# EAGLE design pan_schematic (EAGLE 9.6.2)
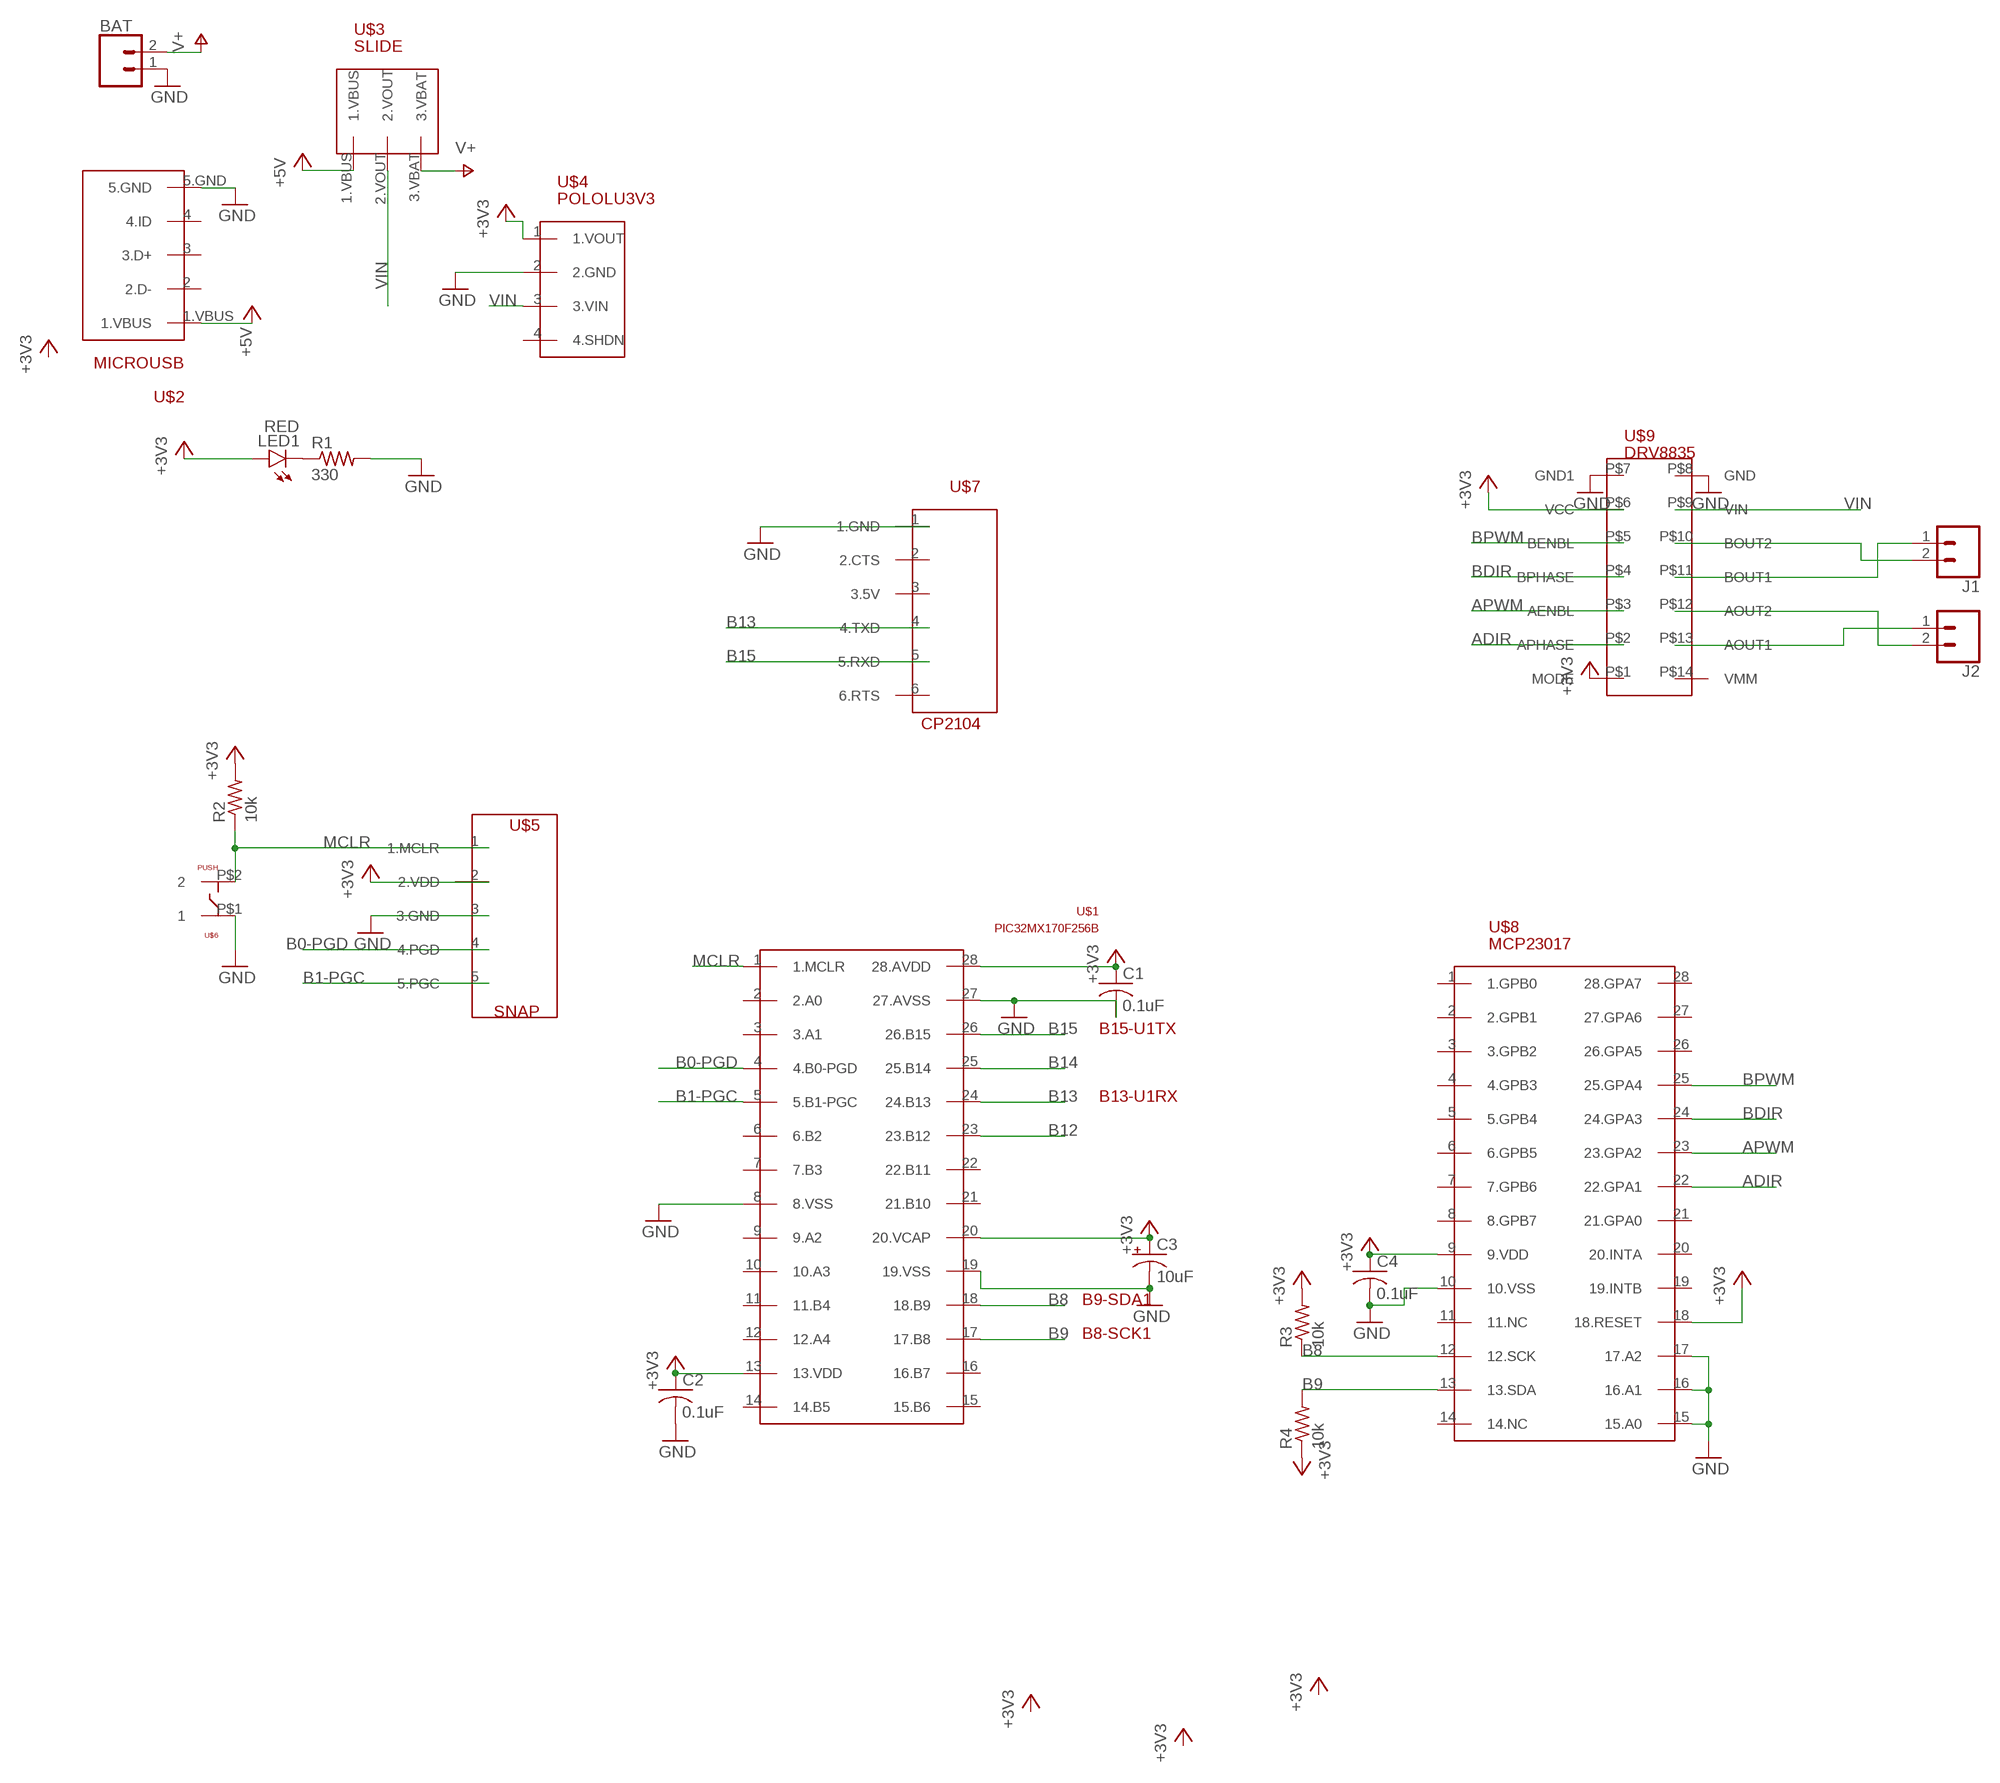
[diagram p0: schematic, sheet 1]

## Parts
BAT  CONN_02  [1X02]
C1  0.1uF  C-US025-030X050  [C025-030X050]
C2  0.1uF  C-US025-030X050  [C025-030X050]
C3  10uF  CPOL-USB45181B  [B45181B]
C4  0.1uF  C-US025-030X050  [C025-030X050]
J1  CONN_02POLAR  [MOLEX-1X2]
J2  CONN_02POLAR  [MOLEX-1X2]
LED1  RED  LED3MM  [LED3MM]
R1  330  R-US_0207/10  [0207/10]
R2  10k  R-US_0207/10  [0207/10]
R3  10k  R-US_M2012  [M2012]
R4  10k  R-US_M2012  [M2012]
U$1  PIC32MX170F256B  [DIL28-3]
U$2  MICROUSB  [MICROUSB]
U$3  SLIDE  [SLIDE]
U$4  POLOLU3V3  [POLOLU3V3]
U$5  SNAP  [1X05_1.27MM]
U$6  PUSH  [PUSH]
U$7  CP2104  [1X06]
U$8  MCP23017  [MCP23017]
U$9  DRV8835  [DRV8835]

## Nets
+3V3: C1.1 C2.1 C3.+ C4.1 LED1.A R2.2 R3.2 R4.1 U$1.13(13.VDD) U$1.20(20.VCAP) U$1.28(28.AVDD) U$4.1(1.VOUT) U$5.2(2.VDD) U$8.9(9.VDD) U$8.18(18.RESET) U$9.P$6(VCC)
+5V: U$2.1.VBUS U$3.1.VBUS
ADIR: U$8.22(22.GPA1) U$9.P$2(APHASE)
APWM: U$8.23(23.GPA2) U$9.P$3(AENBL)
B0-PGD: U$1.4(4.B0-PGD) U$5.4(4.PGD)
B1-PGC: U$1.5(5.B1-PGC) U$5.5(5.PGC)
B8: R3.1 U$1.18(18.B9) U$8.12(12.SCK)
B9: R4.2 U$1.17(17.B8) U$8.13(13.SDA)
B12: U$1.23(23.B12)
B13: U$1.24(24.B13) U$7.4(4.TXD)
B14: U$1.25(25.B14)
B15: U$1.26(26.B15) U$7.5(5.RXD)
BDIR: U$8.24(24.GPA3) U$9.P$4(BPHASE)
BPWM: U$8.25(25.GPA4) U$9.P$5(BENBL)
GND: BAT.1 C1.2 C2.2 C3.- C4.2 R1.2 U$1.8(8.VSS) U$1.19(19.VSS) U$1.27(27.AVSS) U$2.5.GND U$4.2(2.GND) U$5.3(3.GND) U$6.P$1 U$7.1(1.GND) U$8.10(10.VSS) U$8.15(15.A0) U$8.16(16.A1) U$8.17(17.A2)
MCLR: R2.1 U$1.1(1.MCLR) U$5.1(1.MCLR) U$6.P$2
N$1: LED1.K(C) R1.1
N$2: J1.1 U$9.P$11(BOUT1)
N$3: J1.2 U$9.P$10(BOUT2)
N$4: J2.2 U$9.P$12(AOUT2)
N$5: J2.1 U$9.P$13(AOUT1)
V+: BAT.2 U$3.3.VBAT
VIN: U$3.2.VOUT U$4.3(3.VIN) U$9.P$9(VIN)
Unconnected: U$1.2(2.A0) U$1.3(3.A1) U$1.6(6.B2) U$1.7(7.B3) U$1.9(9.A2) U$1.10(10.A3) U$1.11(11.B4) U$1.12(12.A4) U$1.14(14.B5) U$1.15(15.B6) U$1.16(16.B7) U$1.21(21.B10) U$1.22(22.B11) U$2.2(2.D-) U$2.3(3.D+) U$2.4(4.ID) U$4.4(4.SHDN) U$7.2(2.CTS) U$7.3(3.5V) U$7.6(6.RTS) U$8.1(1.GPB0) U$8.2(2.GPB1) U$8.3(3.GPB2) U$8.4(4.GPB3) U$8.5(5.GPB4) U$8.6(6.GPB5) U$8.7(7.GPB6) U$8.8(8.GPB7) U$8.11(11.NC) U$8.14(14.NC) U$8.19(19.INTB) U$8.20(20.INTA) U$8.21(21.GPA0) U$8.26(26.GPA5) U$8.27(27.GPA6) U$8.28(28.GPA7) U$9.P$1(MODE) U$9.P$7(GND1) U$9.P$8(GND) U$9.P$14(VMM)

## Notes on the sheet
- B15-U1TX
- B13-U1RX
- B9-SDA1
- B8-SCK1

## Library data of the parts
BAT = pan_pic32:CONN_02: Multi connection point. Often used as Generic Header-pin footprint for 0.1 inch spaced/style header connections On any of the 0.1 inch spaced packages, you can populate with these: Break Away Headers - Straight <https://www.sparkfun.com/products/116> (PRT-00116) Break Away Male Headers - Right Angle <https://www.sparkfun.com/products/553> (PRT-00553) Female Headers <https://www.sparkfun.com/products/115> (PRT-00115) Break Away Headers - Machine Pin <https://www.sparkfun.com/products/117> (PRT-00117) Break Away Female Headers - Swiss Machine Pin <https://www.sparkfun.com/products/743> (PRT-00743) For SCREWTERMINALS and SPRING TERMINALS visit here: Screw Terimnals on SparkFun.com <https://www.sparkfun.com/search/results?term=Screw+Terminals> (5mm/3.5mm/2.54mm spacing) This device is also useful as a general connection point to wire up your design to another part of your project. Our various solder wires solder well into these plated through hole pads. Hook-Up Wire - Assortment (Stranded, 22 AWG) <https://www.sparkfun.com/products/11375> (PRT-11375) Hook-Up Wire - Assortment (Solid Core, 22 AWG) <https://www.sparkfun.com/products/11367> (PRT-11367) View the entire wire category on our website here <https://www.sparkfun.com/categories/141> Special notes: Molex polarized connector foot print use with: PRT-08233 with associated crimp pins and housings. 2.54_SCREWTERM for use with PRT-10571. 3.5mm Screw Terminal footprints for PRT-08084 5mm Screw Terminal footprints for use with PRT-08432
C1 C2 C4 = pan_pic32:C-US: CAPACITOR, American symbol; SPICEPREFIX: C
C3 = pan_pic32:CPOL-US: POLARIZED CAPACITOR, American symbol; SPICEPREFIX: C
J1 J2 = pan_pic32:CONN_02: Multi connection point. Often used as Generic Header-pin footprint for 0.1 inch spaced/style header connections On any of the 0.1 inch spaced packages, you can populate with these: Break Away Headers - Straight <https://www.sparkfun.com/products/116> (PRT-00116) Break Away Male Headers - Right Angle <https://www.sparkfun.com/products/553> (PRT-00553) Female Headers <https://www.sparkfun.com/products/115> (PRT-00115) Break Away Headers - Machine Pin <https://www.sparkfun.com/products/117> (PRT-00117) Break Away Female Headers - Swiss Machine Pin <https://www.sparkfun.com/products/743> (PRT-00743) For SCREWTERMINALS and SPRING TERMINALS visit here: Screw Terimnals on SparkFun.com <https://www.sparkfun.com/search/results?term=Screw+Terminals> (5mm/3.5mm/2.54mm spacing) This device is also useful as a general connection point to wire up your design to another part of your project. Our various solder wires solder well into these plated through hole pads. Hook-Up Wire - Assortment (Stranded, 22 AWG) <https://www.sparkfun.com/products/11375> (PRT-11375) Hook-Up Wire - Assortment (Solid Core, 22 AWG) <https://www.sparkfun.com/products/11367> (PRT-11367) View the entire wire category on our website here <https://www.sparkfun.com/categories/141> Special notes: Molex polarized connector foot print use with: PRT-08233 with associated crimp pins and housings. 2.54_SCREWTERM for use with PRT-10571. 3.5mm Screw Terminal footprints for PRT-08084 5mm Screw Terminal footprints for use with PRT-08432; SF_ID: PRT-09918
LED1 = pan_pic32:LED: LED OSRAM: - CHIPLED LG R971, LG N971, LY N971, LG Q971, LY Q971, LO R971, LY R971 LH N974, LH R974 LS Q976, LO Q976, LY Q976 LO Q996 - Hyper CHIPLED LW Q18S LB Q993, LB Q99A, LB R99A - SideLED LS A670, LO A670, LY A670, LG A670, LP A670 LB A673, LV A673, LT A673, LW A673 LH A674 LY A675 LS A676, LA A676, LO A676, LY A676, LW A676 LS A679, LY A679, LG A679 - Hyper Micro SIDELED® LS Y876, LA Y876, LO Y876, LY Y876 LT Y87S - SmartLED LW L88C, LW L88S LB L89C, LB L89S, LG L890 LS L89K, LO L89K, LY L89K LS L896, LA L896, LO L896, LY L896 - TOPLED LS T670, LO T670, LY T670, LG T670, LP T670 LSG T670, LSP T670, LSY T670, LOP T670, LYG T670 LG T671, LOG T671, LSG T671 LB T673, LV T673, LT T673, LW T673 LH T674 LS T676, LA T676, LO T676, LY T676, LB T676, LH T676, LSB T676, LW T676 LB T67C, LV T67C, LT T67C, LS T67K, LO T67K, LY T67K, LW E67C LS E67B, LA E67B, LO E67B, LY E67B, LB E67C, LV E67C, LT E67C LW T67C LS T679, LY T679, LG T679 LS T770, LO T770, LY T770, LG T770, LP T770 LB T773, LV T773, LT T773, LW T773 LH T774 LS E675, LA E675, LY E675, LS T675 LS T776, LA T776, LO T776, LY T776, LB T776 LHGB T686 LT T68C, LB T68C - Hyper Mini TOPLED® LB M676 - Mini TOPLED Santana® LG M470 LS M47K, LO M47K, LY M47K Source: http://www.osram.convergy.de LUXEON: - LUMILED® LXK2-PW12-R00, LXK2-PW12-S00, LXK2-PW14-U00, LXK2-PW14-V00 LXK2-PM12-R00, LXK2-PM12-S00, LXK2-PM14-U00 LXK2-PE12-Q00, LXK2-PE12-R00, LXK2-PE12-S00, LXK2-PE14-T00, LXK2-PE14-U00 LXK2-PB12-K00, LXK2-PB12-L00, LXK2-PB12-M00, LXK2-PB14-N00, LXK2-PB14-P00, LXK2-PB14-Q00 LXK2-PR12-L00, LXK2-PR12-M00, LXK2-PR14-Q00, LXK2-PR14-R00 LXK2-PD12-Q00, LXK2-PD12-R00, LXK2-PD12-S00 LXK2-PH12-R00, LXK2-PH12-S00 LXK2-PL12-P00, LXK2-PL12-Q00, LXK2-PL12-R00 Source: www.luxeon.com KINGBRIGHT: KA-3528ASYC Source: www.kingbright.com
R1-R4 = pan_pic32:R-US_: RESISTOR, American symbol; SPICEPREFIX: R
U$1 = pan_pic32:PIC32MX170F256B
U$2 = pan_pic32:MICROUSB
U$3 = pan_pic32:SLIDE
U$4 = pan_pic32:POLOLU3V3
U$5 = pan_pic32:SNAP
U$6 = pan_pic32:PUSH
U$7 = pan_pic32:CP2104
U$8 = pan_pic32:MCP23017
U$9 = pan_pic32:DRV8835

## Board
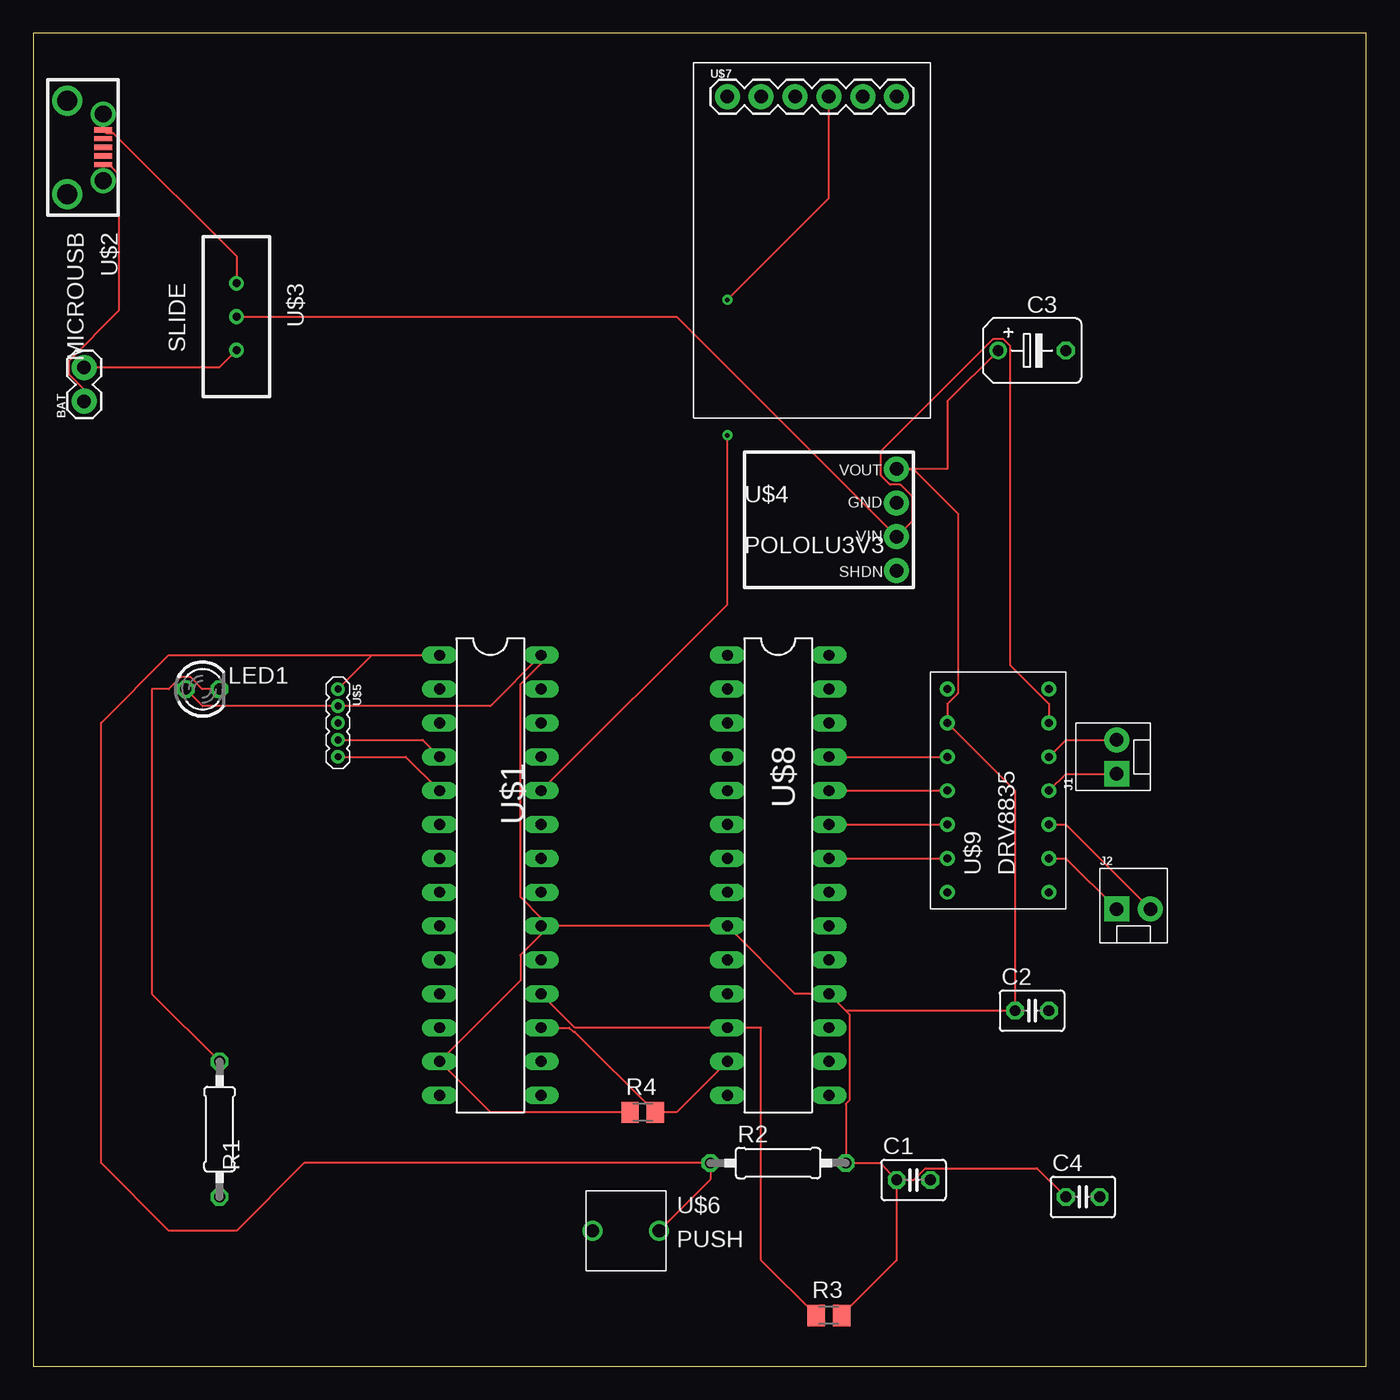
[diagram p1: board, top side]
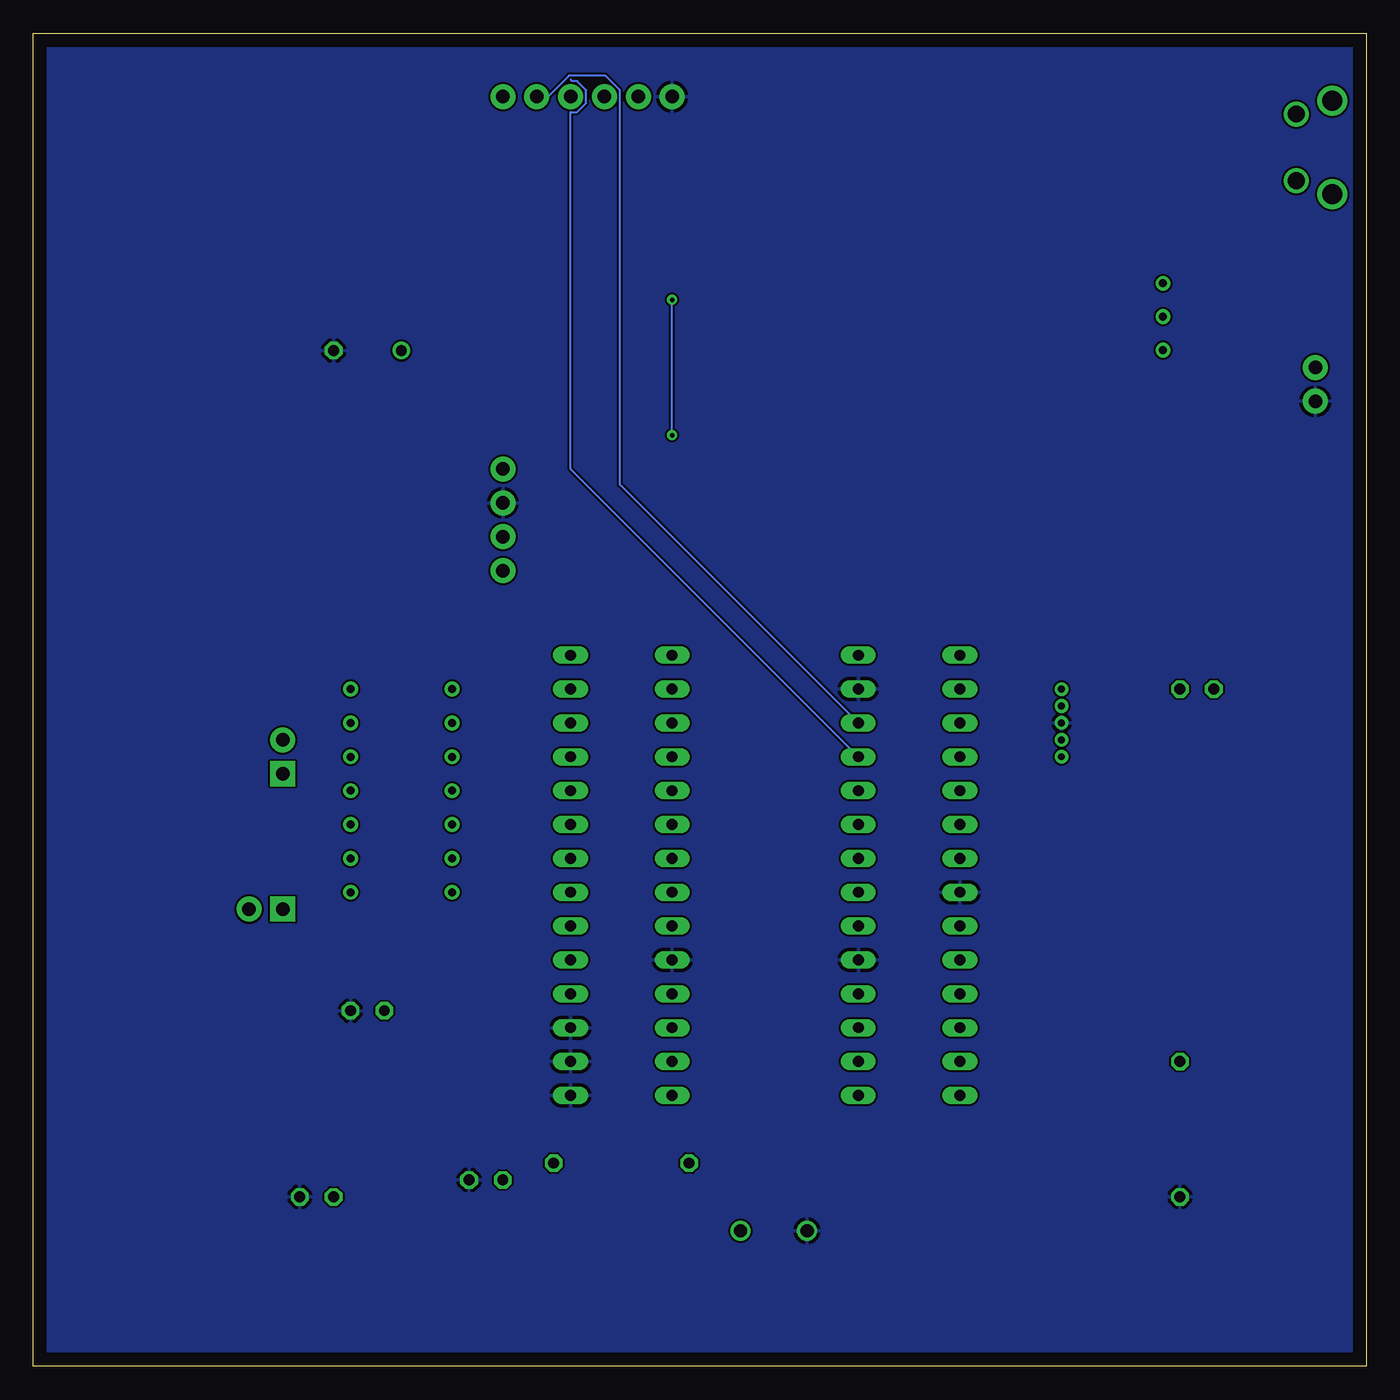
[diagram p2: board, bottom side, seen from below]

Size 100 x 100 mm. Coordinates in mm from the lower left corner, seen from the top.
Outline: 0,0 100,0 100,100 0,100 0,0
Copper layers (1*16): Top 0.035mm / dielectric 1.5mm / Bottom 0.035mm
Design rules "default": minimum track width 6mil, minimum drill 0.35mm, track to track 6mil, track to pad 6mil, pad to pad 6mil, via to via 6mil, smd to smd 6mil, copper to edge 40mil, drill to drill 6mil, minimum pad ring 10mil, minimum via ring 8mil, stop-mask expansion 4mil, vias tented up to drill 0mil, thermal gap 10mil

### Footprints (pad centres in the part's own frame; a part is rotated, then mirrored left to right if it is on the bottom)
1X02 = drill 1.016 pad 1.88: 1 0,0; 2 2.54,0
C025-030X050 = drill 0.813 octagon: 1 -1.27,0; 2 1.27,0
B45181B = drill 0.813: + -2.54,0 | drill 0.813 octagon: - 2.54,0
MOLEX-1X2 = drill 1.016 pad 1.88 square: 1 0,0 | drill 1.016 pad 1.88: 2 2.54,0
LED3MM = drill 0.813 octagon: A -1.27,0; K 1.27,0
0207/10 = drill 0.813 octagon: 1 -5.08,0; 2 5.08,0
M2012 = smd 1.3 x 1.6: 1 -0.95,0; 2 0.95,0
DIL28-3 = drill 0.813 long: 1 -16.51,-3.81; 2 -13.97,-3.81; 3 -11.43,-3.81; 4 -8.89,-3.81; 5 -6.35,-3.81; 6 -3.81,-3.81; 7 -1.27,-3.81; 8 1.27,-3.81; 9 3.81,-3.81; 10 6.35,-3.81; 11 8.89,-3.81; 12 11.43,-3.81; 13 13.97,-3.81; 14 16.51,-3.81; 15 16.51,3.81; 16 13.97,3.81; 17 11.43,3.81; 18 8.89,3.81; 19 6.35,3.81; 20 3.81,3.81; 21 1.27,3.81; 22 -1.27,3.81; 23 -3.81,3.81; 24 -6.35,3.81; 25 -8.89,3.81; 26 -11.43,3.81; 27 -13.97,3.81; 28 -16.51,3.81
MICROUSB = smd 0.4 x 1.35: 1.VBUS -1.3,2.7; 2 -0.65,2.7; 3 0,2.7; 4 0.65,2.7; 5.GND 1.3,2.7 | drill 1.25 pad 1.676: 6 -2.5,2.7; 7 2.5,2.7 | drill 1.5: 8 -3.5,0; 9 3.5,0
SLIDE = drill 0.6: 1.VBUS -2.5,0; 2.VOUT 0,0; 3.VBAT 2.5,0
POLOLU3V3 = drill 1.016 pad 1.88: 1 0,3.81; 2 0,1.27; 3 0,-1.27; 4 0,-3.81
1X05_1.27MM = drill 0.508 pad 1: 1 0,0; 2 1.27,0; 3 2.54,0; 4 3.81,0; 5 5.08,0
PUSH = drill 1: P$1 -2.5,0; P$2 2.5,0
1X06 = drill 1.016 pad 1.88: 1 0,0; 2 2.54,0; 3 5.08,0; 4 7.62,0; 5 10.16,0; 6 12.7,0
MCP23017 = drill 0.813 long: 1 -16.51,-3.81; 2 -13.97,-3.81; 3 -11.43,-3.81; 4 -8.89,-3.81; 5 -6.35,-3.81; 6 -3.81,-3.81; 7 -1.27,-3.81; 8 1.27,-3.81; 9 3.81,-3.81; 10 6.35,-3.81; 11 8.89,-3.81; 12 11.43,-3.81; 13 13.97,-3.81; 14 16.51,-3.81; 15 16.51,3.81; 16 13.97,3.81; 17 11.43,3.81; 18 8.89,3.81; 19 6.35,3.81; 20 3.81,3.81; 21 1.27,3.81; 22 -1.27,3.81; 23 -3.81,3.81; 24 -6.35,3.81; 25 -8.89,3.81; 26 -11.43,3.81; 27 -13.97,3.81; 28 -16.51,3.81
DRV8835 = drill 0.6 pad 1.02: P$1 -3.81,-7.62; P$2 -3.81,-5.08; P$3 -3.81,-2.54; P$4 -3.81,0; P$5 -3.81,2.54; P$6 -3.81,5.08; P$7 -3.81,7.62; P$8 3.81,7.62; P$9 3.81,5.08; P$10 3.81,2.54; P$11 3.81,0; P$12 3.81,-2.54; P$13 3.81,-5.08; P$14 3.81,-7.62

### Placement (x,y rotation side)
BAT  3.81,72.39 90 top
C1  66.04,13.97 0 top
C2  74.93,26.67 0 top
C3  74.93,76.2 0 top
C4  78.74,12.7 0 top
J1  81.28,44.45 90 top
J2  81.28,34.29 0 top
LED1  12.7,50.8 0 top
R1  13.97,17.78 270 top
R2  55.88,15.24 0 top
R3  59.69,3.81 0 top
R4  45.72,19.05 0 top
U$1  34.29,36.83 270 top
U$2  2.54,91.44 270 top
U$3  15.24,78.74 270 top
U$4  64.77,63.5 0 top
U$5  22.86,50.8 270 top
U$6  44.45,10.16 0 top
U$7  52.07,95.25 0 top
U$8  55.88,36.83 270 top
U$9  72.39,43.18 0 top

### Tracks (layer width: path | path; a pad name or v marks a point on that pad's centre or on a via)
+3V3
  Top 0.152: C3.+ 68.58,72.39 68.58,67.31 U$4.1 66.04,67.31 69.36,63.99 69.36,50.48 68.58,49.69 U$9.P$6 73.66,43.18 C2.1 60.96,26.67 | 60.96,26.67 U$8.18 57.15,27.94 U$8.9 U$1.20 | 60.96,26.67 61.24,26.39 61.24,19.95 60.96,19.67 R2.2 63.5,15.24 C1.1 | C1.1 66.05,13.97 66.94,14.86 75.31,14.86 C4.1 | C1.1 64.77,7.94 R3.2 | U$1.20 38.1,32.4 36.55,30.85 36.55,28.93 U$1.13 34.29,19.05 R4.1 | U$1.20 38.1,33.64 36.55,35.19 36.55,51.17 38.1,52.72 U$1.28 34.29,49.53 U$5.2 12.7,49.53 LED1.A
+5V
  Top 0.152: U$2.1.VBUS 5.46,92.52 6.01,92.52 15.24,83.29 U$3.1.VBUS
ADIR
  Top 0.152: U$8.22 U$9.P$2
APWM
  Top 0.152: U$8.23 U$9.P$3
B0-PGD
  Top 0.152: U$5.4 29.21,46.99 U$1.4
B1-PGC
  Top 0.152: U$5.5 27.94,45.72 U$1.5
B8
  Top 0.152: R3.1 54.61,7.94 54.61,25.4 U$8.12 40.64,25.4 U$1.18
B9
  Top 0.152: U$1.17 40.21,25.4 40.51,25.09 40.62,25.09 R4.2 48.26,19.05 U$8.13
B13  (via drill 0.35)
  Top 0.152: U$1.24 52.07,57.15 v52.07,69.85 | v52.07,80.01 59.69,87.63 U$7.4
  Bottom 0.152: v52.07,69.85 v52.07,80.01
B14
  Bottom 0.152: U$1.25 59.69,67.31 59.69,94.08 59.21,94.08 58.52,94.77 58.52,95.73 59.21,96.42 59.59,96.42 59.69,96.52
B15
  Bottom 0.152: U$1.26 55.98,66.14 55.98,95.73 57.07,96.83 59.82,96.83 61.39,95.25 U$7.5
BDIR
  Top 0.152: U$8.24 U$9.P$4
BPWM
  Top 0.152: U$8.25 U$9.P$5
GND
  Top 0.152: U$2.5.GND 5.27,90.11 5.72,90.11 6.41,89.42 6.41,79.18 2.64,75.41 2.64,74.45 3.81,73.28 BAT.1
  pour Bottom: 0,100.33 0,0 100.33,0 100.33,100.33
MCLR
  Top 0.152: U$6.P$2 50.8,14.01 R2.1 20.32,15.24 15.24,10.16 10.16,10.16 5.08,15.24 5.08,48.26 10.16,53.34 U$1.1 | U$5.1 25.4,53.34 U$1.1 | 31.75,53.34 U$1.1
N$1
  Top 0.152: LED1.K 12.69,50.8 11.8,51.69 11.06,51.69 10.17,50.8 8.89,50.8 8.89,27.94 R1.1
N$2
  Top 0.152: U$9.P$11 77.47,44.45 J1.1
N$3
  Top 0.152: U$9.P$10 77.47,46.99 J1.2
N$4
  Top 0.152: U$9.P$12 77.47,40.64 J2.2
N$5
  Top 0.152: U$9.P$13 77.47,38.1 J2.1
V+
  Top 0.152: U$3.3.VBAT 13.93,74.93 BAT.2
VIN
  Top 0.152: U$3.2.VOUT 48.26,78.74 U$4.3 65.94,63.4 65.94,65.25 65.05,66.14 64.29,66.14 63.6,66.83 63.6,68.67 72.02,77.09 72.76,77.09 73.28,76.57 73.28,52.61 76.2,49.69 U$9.P$9